# EAGLE design main (EAGLE 7.6.0)
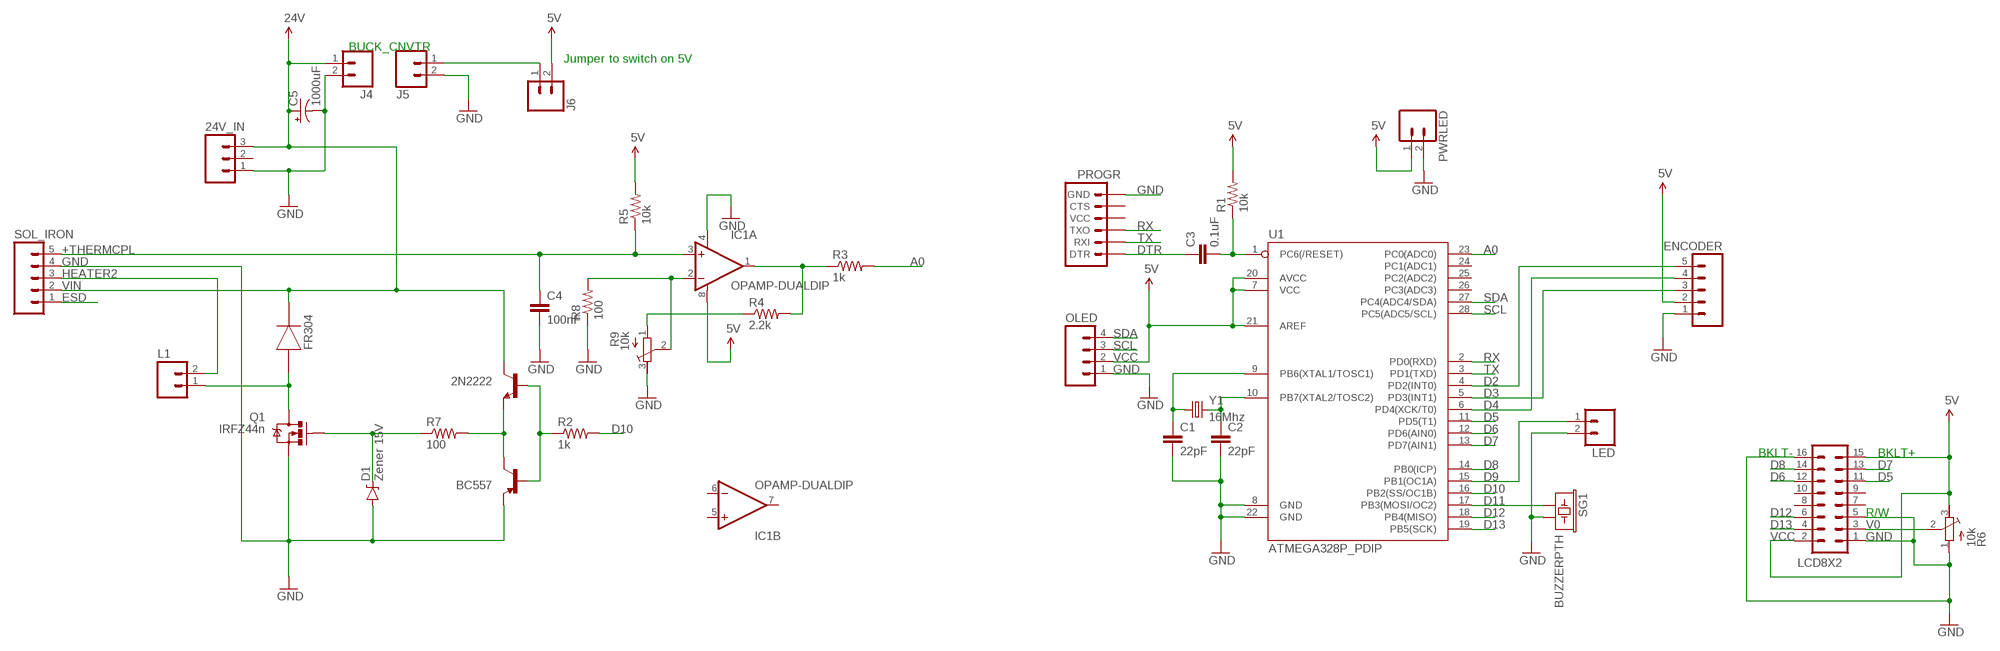
[diagram p0: schematic, sheet 1]

## Parts
2N2222  TRANSISTOR_NPNP2N2222A  [TO-92]
24V_IN  M03PTH  [1X03]
BC557  TRANSISTOR_PNPTO92  [TO-92]
C1  22pF  CAPPTH  [CAP-PTH-SMALL]
C2  22pF  CAPPTH  [CAP-PTH-SMALL]
C3  0.1uF  CAPPTH  [CAP-PTH-SMALL]
C4  100nF  CAPPTH  [CAP-PTH-SMALL]
C5  1000uF  CAP_POLPTH4  [CPOL-RADIAL-1000UF-25V]
D1  Zener 15V  DIODE-ZENERPTH  [DIODE-ZENER]
ENCODER  M05PTH  [1X05]
IC1  OPAMP-DUALDIP  [DIP08]
J4  M02PTH  [1X02]
J5  M02PTH  [1X02]
J6  M02PTH  [1X02]
L1  M02PTH  [1X02]
LCD8X2  M08X2  [2X8]
LED  M02PTH  [1X02]
OLED  M04PTH  [1X04]
PROGR  ARDUINO_SERIAL_PROGRAMPTH  [1X06]
PWRLED  M02PTH  [1X02]
Q1  IRFZ44n  MOSFET-NCHANNELFQP30N06L  [TO220V]
R1  10k  RESISTORPTH-1/4W  [AXIAL-0.4]
R2  1k  RESISTORPTH-1/4W  [AXIAL-0.4]
R3  1k  RESISTORPTH-1/4W  [AXIAL-0.4]
R4  2.2k  RESISTORPTH-1/4W  [AXIAL-0.4]
R5  10k  RESISTORPTH-1/4W  [AXIAL-0.4]
R6  10k  R-TRIMM3296W  [RTRIM3296W]
R7  100  RESISTORPTH-1/4W  [AXIAL-0.4]
R8  100  RESISTORPTH-1/4W  [AXIAL-0.4]
R9  10k  R-TRIMM3296W  [RTRIM3296W]
SG1  BUZZERPTH  [BUZZER-12MM]
SOL_IRON  M05PTH  [1X05]
U1  ATMEGA328P_PDIP  [DIL28-3]
U$1  FR304  [FR304]
Y1  16Mhz  CRYSTALHC49US  [HC49US]

## Nets
+THERMCPL: C4.1 IC1.3(A:+IN) R5.P$1 SOL_IRON.5
A0: R3.P$2 U1.23(PC0(ADC0))
D2: ENCODER.5 U1.4(PD2(INT0))
D3: ENCODER.3 U1.5(PD3(INT1))
D4: ENCODER.4 U1.6(PD4(XCK/T0))
D5: LCD8X2.11 U1.11(PD5(T1))
D6: LCD8X2.12 U1.12(PD6(AIN0))
D7: LCD8X2.13 U1.13(PD7(AIN1))
D8: LCD8X2.14 U1.14(PB0(ICP))
D9: LED.1 U1.15(PB1(OC1A))
D10: R2.P$2 U1.16(PB2(SS/OC1B))
D11: SG1.+ U1.17(PB3(MOSI/OC2))
D12: LCD8X2.6 U1.18(PB4(MISO))
D13: LCD8X2.4 U1.19(PB5(SCK))
DTR: C3.1 PROGR.1(DTR)
ESD: SOL_IRON.1
GND [ground]: 24V_IN.1 BC557.1(E) C1.2 C2.2 C4.2 C5.- D1.P$2(A) ENCODER.1 IC1.4(A:V-) J4.2 J5.2 LCD8X2.1 LCD8X2.5 LCD8X2.16 LED.2 OLED.1 PROGR.6(GND) PWRLED.2 Q1.3(S) R6.1(A) R8.P$1 R9.3(E) SG1.- SOL_IRON.4 U1.8(GND) U1.22(GND)
HEATER2: L1.2 SOL_IRON.3
N$1: C1.1 U1.9(PB6(XTAL1/TOSC1)) Y1.1
N$2: C2.1 U1.10(PB7(XTAL2/TOSC2)) Y1.2
N$4: C3.2 R1.P$1 U1.1(PC6(/RESET))
N$5: 2N2222.3(E) BC557.3(C) R7.P$2
N$6: D1.P$1(C) Q1.1(G) R7.P$1
N$7: L1.1 Q1.2(D) U$1.A(ANODE)
N$8: IC1.2(A:-IN) R8.P$2 R9.2(S)
N$9: 2N2222.2(B) BC557.2(B) R2.P$1
N$10: IC1.1(A:OUT) R3.P$1 R4.P$2
N$11: R4.P$1 R9.1(A)
N$15: J5.1 J6.1
RX: PROGR.3(TXO) U1.2(PD0(RXD))
SCL: OLED.3 U1.28(PC5(ADC5/SCL))
SDA: OLED.4 U1.27(PC4(ADC4/SDA))
TX: PROGR.2(RXI) U1.3(PD1(TXD))
V0: LCD8X2.3 R6.2(S)
VCC [5V]: ENCODER.2 IC1.8(A:V+) J6.2 LCD8X2.2 LCD8X2.15 OLED.2 PWRLED.1 R1.P$2 R5.P$2 R6.3(E) U1.7(VCC) U1.20(AVCC) U1.21(AREF) ; supply symbol labelled 5V
VIN [24V]: 2N2222.1(C) 24V_IN.3 C5.+ J4.1 SOL_IRON.2 U$1.K(CATHODE) ; supply symbol labelled 24V
Unconnected: 24V_IN.2 IC1.5(B:+IN) IC1.6(B:-IN) IC1.7(B:OUT) LCD8X2.7 LCD8X2.8 LCD8X2.9 LCD8X2.10 PROGR.4(VCC) PROGR.5(CTS) U1.24(PC1(ADC1)) U1.25(PC2(ADC2)) U1.26(PC3(ADC3))

## Notes on the sheet
- BUCK_CNVTR
- Jumper to switch on 5V
- BKLT- | BKLT+
- R/W

## Library data of the parts
2N2222 = SparkFun-DiscreteSemi:TRANSISTOR_NPN: Generic NPN BJT MMBT2222A - TRANS-08049 (SOT-23, 1A 40V) MPSA42 - TRANS-09116 (SOT-23, 500mA 300V) MMBT5088LT1G - TRANS-11160 (SOT-23, 50 mA 30V) BC547 - COM-08928 <http://www.sparkfun.com/products/8928> (TO-92 45V 100mA) (1.Collector 2.Base 3.Emitter) 2N3904 - COM-00521 <http://www.sparkfun.com/products/521> (TO-92 40V 200mA) (1.Emitter 2.Base 3.Collector) P2N2222A - COM-12852 <http://www.sparkfun.com/products/12852> (TO-92 40V 600mA) (1.Collector 2.Base 3.Emitter); PROD_ID: TRANS-09536
24V_IN = SparkFun-Connectors:M03: Header 3 Standard 3-pin 0.1" header. Use with straight break away headers (SKU : PRT-00116), right angle break away headers (PRT-00553), swiss pins (PRT-00743), machine pins (PRT-00117), and female headers (PRT-00115). Molex polarized connector foot print use with SKU : PRT-08232 with associated crimp pins and housings.
BC557 = SparkFun-DiscreteSemi:TRANSISTOR_PNP: Generic PNP BJT Double check pinouts against datasheets- not all devices are the same! MMBT3906 - 40V 200mA SOT-23 (TRANS-08052) MMBT4403 - 40V 600mA SOT-23 (TRANS-09245)
C1-C4 = SparkFun-Capacitors:CAP: Capacitor Standard 0603 ceramic capacitor, and 0.1" leaded capacitor.
C5 = SparkFun-Capacitors:CAP_POL: Capacitor Polarized These are standard SMD and PTH capacitors. Normally 10uF, 47uF, and 100uF in electrolytic and tantalum varieties. Always verify the external diameter of the through hole cap, it varies with capacity, voltage, and manufacturer. The EIA devices should be standard.
D1 = SparkFun-DiscreteSemi:DIODE-ZENER: Zener Diode Production Part - 8199 3.4V Zener Voltage
ENCODER SOL_IRON = SparkFun-Connectors:M05: Header 5 Standard 5-pin 0.1" header. Use with straight break away headers (SKU : PRT-00116), right angle break away headers (PRT-00553), swiss pins (PRT-00743), machine pins (PRT-00117), and female headers (PRT-00115). Molex polarized connector foot print use with SKU : PRT-08230 with associated crimp pins and housings.
IC1 = SparkFun-AnalogIC:OPAMP-DUAL: Generic op-amp footprint
J4-J6 L1 LED PWRLED = SparkFun-Connectors:M02: Standard 2-pin 0.1" header. Use with - straight break away headers ( PRT-00116) - right angle break away headers (PRT-00553) - swiss pins (PRT-00743) - machine pins (PRT-00117) - female headers (PRT-00115) Molex polarized connector foot print use with: PRT-08233 with associated crimp pins and housings. 2.54_SCREWTERM for use with PRT-10571. 3.5mm Screw Terminal footprints for PRT-08084 5mm Screw Terminal footprints for use with PRT-08432
LCD8X2 = SparkFun-Connectors:M08X2: .1" headers, two rows of 8 each
OLED = SparkFun-Connectors:M04: Header 4 Standard 4-pin 0.1" header. Use with straight break away headers (SKU : PRT-00116), right angle break away headers (PRT-00553), swiss pins (PRT-00743), machine pins (PRT-00117), and female headers (PRT-00115). Molex polarized connector foot print use with SKU : PRT-08231 with associated crimp pins and housings. 1MM SMD Version SKU: PRT-10208; PROD_ID: CONN-09696
PROGR = SparkFun-Connectors:ARDUINO_SERIAL_PROGRAM: FTDI connector footprints
Q1 = SparkFun-DiscreteSemi:MOSFET-NCHANNEL: Common NMOSFET Parts MFG P/N Store ID Prod ID FDD8780 TRANS-09984 SI7820DN TRANS-11055 FDS6630A IC-08089 2N7002PW TRANS-11151 FQP30N06L COM-10213 TRANS-10060 BSS123LT1G TRANS-08345 BSS138 TRANS-00830 BS170 2N7000; PROD_ID: TRANS-10060
R1-R5 R7 R8 = SparkFun-Resistors:RESISTOR: Resistor Basic schematic elements and footprints for 0603, 1206, and PTH resistors.
R6 R9 = resistor:R-TRIMM: Trimm resistor
SG1 = SparkFun-Electromechanical:BUZZER: Buzzer 12mm Spark Fun Electronics SKU : Comp-Buzzer
U1 = SparkFun-DigitalIC:ATMEGA328P_PDIP: uC used in the Arduino 32kb flash, 1k EEPROM, 2k SRAM This is the through-hole version of this chip.
U$1 = Created:FR304
Y1 = SparkFun-FreqCtrl:CRYSTAL: Various standard crystals. Proven footprints.

## Net classes
0 default: width 0.406 mm, clearance 0.203 mm
1 ground: width 0.61 mm, clearance 0.203 mm
2 24V: width 1.016 mm, clearance 0.203 mm
3 5V: width 0.61 mm, clearance 0.203 mm

## Board
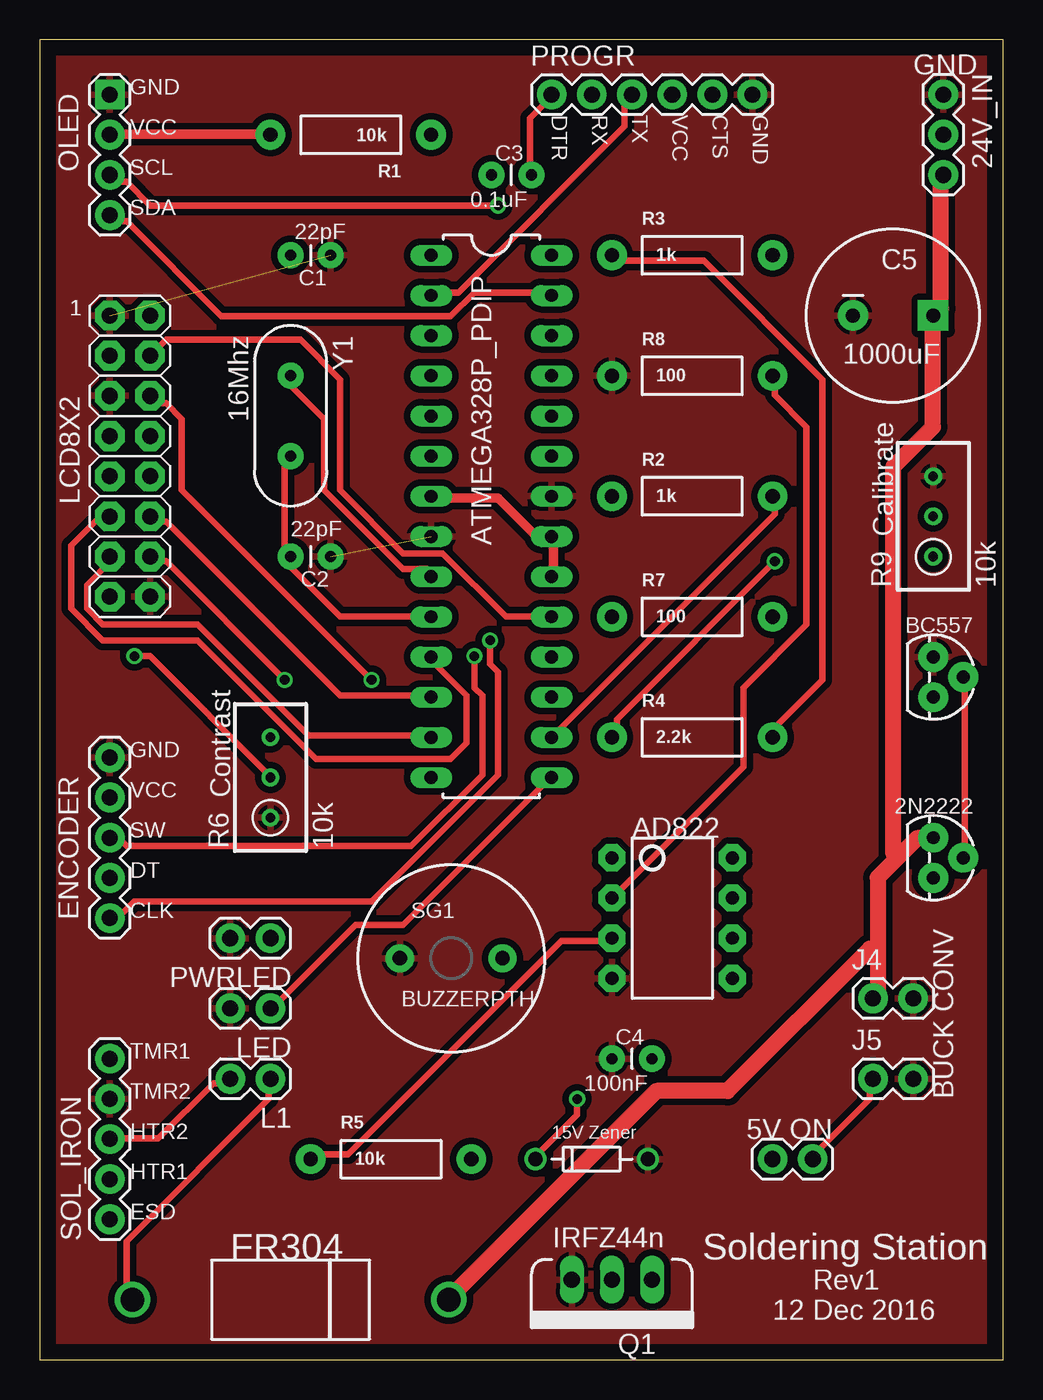
[diagram p1: board, top side]
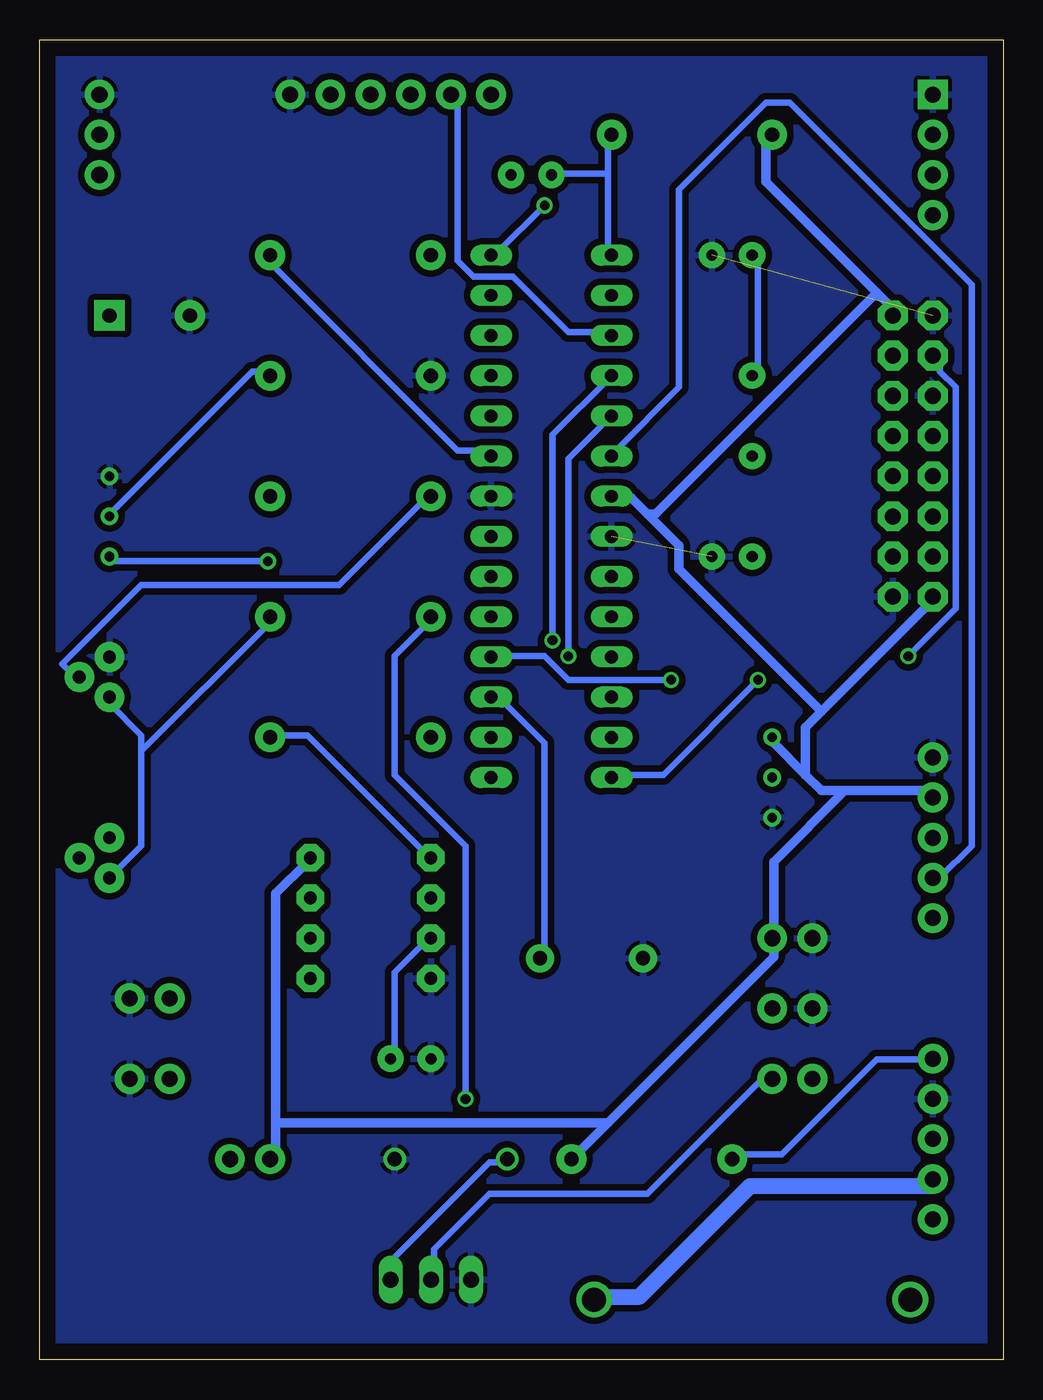
[diagram p2: board, bottom side, seen from below]

Size 60.94 x 83.49 mm. Coordinates in mm from the lower left corner, seen from the top.
Outline: 0,0 60.94,0 60.94,83.49 0,83.49 0,0
Copper layers (1*16): Top 0.035mm / dielectric 1.5mm / Bottom 0.035mm
Design rules "default": minimum track width 10mil, minimum drill 24mil, track to track 8mil, track to pad 8mil, pad to pad 8mil, via to via 8mil, smd to smd 8mil, copper to edge 40mil, drill to drill 8mil, minimum pad ring 10mil, minimum via ring 8mil, stop-mask expansion 4mil, vias tented up to drill 0mil, thermal gap 10mil

### Footprints (pad centres in the part's own frame; a part is rotated, then mirrored left to right if it is on the bottom)
TO-92 = drill 0.813 pad 1.88: 1 -1.27,0; 2 0,1.905; 3 1.27,0
1X03 = drill 1.016 pad 1.88: 1 0,0; 2 2.54,0; 3 5.08,0
CAP-PTH-SMALL = drill 0.7 pad 1.651: 1 0,0; 2 2.54,0
CPOL-RADIAL-1000UF-25V = drill 0.9 pad 1.93 square: + 2.54,0 | drill 0.9 pad 1.93: - -2.54,0
DIODE-ZENER = drill 0.9: P$1 -3.556,0; P$2 3.556,0
1X05 = drill 1.016 pad 1.88: 1 0,0; 2 2.54,0; 3 5.08,0; 4 7.62,0; 5 10.16,0
DIP08 = drill 0.813 pad 1.727 octagon: 1 -3.81,-3.81; 2 -1.27,-3.81; 3 1.27,-3.81; 4 3.81,-3.81; 5 3.81,3.81; 6 1.27,3.81; 7 -1.27,3.81; 8 -3.81,3.81
1X02 = drill 1.016 pad 1.88: 1 0,0; 2 2.54,0
2X8 = drill 1.016 pad 1.88 octagon: 1 0,0; 2 0,2.54; 3 2.54,0; 4 2.54,2.54; 5 5.08,0; 6 5.08,2.54; 7 7.62,0; 8 7.62,2.54; 9 10.16,0; 10 10.16,2.54; 11 12.7,0; 12 12.7,2.54; 13 15.24,0; 14 15.24,2.54; 15 17.78,0; 16 17.78,2.54
1X04 = drill 1.016 pad 1.88 square: 1 0,0 | drill 1.016 pad 1.88: 2 2.54,0; 3 5.08,0; 4 7.62,0
1X06 = drill 1.016 pad 1.88: 1 0,0; 2 2.54,0; 3 5.08,0; 4 7.62,0; 5 10.16,0; 6 12.7,0
TO220V = drill 1.016 long: 1 -2.54,0; 2 0,0; 3 2.54,0
AXIAL-0.4 = drill 0.9 pad 1.88: P$1 -5.08,0; P$2 5.08,0
RTRIM3296W = drill 0.61: 1 0,-2.54; 2 0,0; 3 0,2.54
BUZZER-12MM = drill 0.9 pad 1.778: + 3.25,0; - -3.25,0
DIL28-3 = drill 0.813 long: 1 -16.51,-3.81; 2 -13.97,-3.81; 3 -11.43,-3.81; 4 -8.89,-3.81; 5 -6.35,-3.81; 6 -3.81,-3.81; 7 -1.27,-3.81; 8 1.27,-3.81; 9 3.81,-3.81; 10 6.35,-3.81; 11 8.89,-3.81; 12 11.43,-3.81; 13 13.97,-3.81; 14 16.51,-3.81; 15 16.51,3.81; 16 13.97,3.81; 17 11.43,3.81; 18 8.89,3.81; 19 6.35,3.81; 20 3.81,3.81; 21 1.27,3.81; 22 -1.27,3.81; 23 -3.81,3.81; 24 -6.35,3.81; 25 -8.89,3.81; 26 -11.43,3.81; 27 -13.97,3.81; 28 -16.51,3.81
FR304 = drill 1.5 pad 2.184: A -10,0; K 10,0
HC49US = drill 0.7 pad 1.651: 1 -2.54,0; 2 2.54,0

### Placement (x,y rotation side)
2N2222  56.52,31.75 270 top
24V_IN  57.15,80.01 270 top
BC557  56.52,43.18 270 top
C1  15.88,69.85 0 top
C2  15.88,50.8 0 top
C3  31.11,74.93 180 top
C4  38.73,19.05 180 top
C5  53.98,66.04 0 top
D1  34.92,12.7 0 top
ENCODER  4.45,38.1 270 top
IC1  40.01,27.94 270 top
J4  52.7,22.86 0 top
J5  52.7,17.78 0 top
J6  48.9,12.7 180 top
L1  14.61,17.78 180 top
LCD8X2  4.45,66.04 270 top
LED  14.61,22.23 180 top
OLED  4.45,80.01 270 top
PROGR  32.38,80.01 0 top
PWRLED  14.61,26.67 180 top
Q1  36.2,5.08 180 top
R1  19.68,77.47 180 top
R2  41.27,54.61 0 top
R3  41.27,69.85 0 top
R4  41.27,39.37 0 top
R5  22.23,12.7 0 top
R6  14.61,36.83 0 top
R7  41.27,46.99 0 top
R8  41.27,62.23 0 top
R9  56.52,53.34 0 top
SG1  26.04,25.4 0 top
SOL_IRON  4.45,8.89 90 top
U1  28.57,53.34 270 top
U$1  15.88,3.81 0 top
Y1  15.88,59.69 270 top

### Tracks (layer width: path | path; a pad name or v marks a point on that pad's centre or on a via)
+THERMCPL
  Top 0.406: IC1.3 36,26.5 33,26.5 19.5,13 17.5,13 R5.P$1
  Bottom 0.406: C4.1 38.5,19.5 38.5,24.5 36.5,26.5 IC1.3 | SOL_IRON.5 4.5,19 8,19 14,13 17,13 R5.P$1
A0
  Bottom 0.406: U1.23 32.5,57.5 34.5,57.5 46.5,69.5 R3.P$2
D2  (via drill 0.61)
  Top 0.406: v28.5,45.5 28.5,44 29,43.5 29,37 21,29 6,29 4.5,27.5 ENCODER.5
  Bottom 0.406: v28.5,45.5 28.5,58.5 25,62 U1.4
D3  (via drill 0.61)
  Top 0.406: v27.5,44.5 27.5,42.5 28,42 28,37 23.5,32.5 5.5,32.5 4.5,33.5 ENCODER.3
  Bottom 0.406: v27.5,44.5 27.5,57 25,59.5 U1.5
D4
  Bottom 0.406: U1.6 24.5,57.5 20.5,61.5 20.5,74 15,79.5 13.5,79.5 2,68 2,32.5 4,30.5 ENCODER.4
D5
  Top 0.406: U1.11 25,44 27,42 27,39 26,38 17.5,38 10,45.5 4,45.5 2,47.5 2,51.5 4,53.5 LCD8X2.11
D6
  Top 0.406: U1.12 24.5,42 19,42 8,53 7,53 LCD8X2.12
D7
  Top 0.406: U1.13 24.5,39.5 17,39.5 10,46.5 4,46.5 3,47.5 3,49 4.5,50.5 LCD8X2.13
D8  (via drill 0.61)
  Top 0.406: v15.5,43 8,50.5 7,50.5 LCD8X2.14
  Bottom 0.406: v15.5,43 21.5,37 24.5,37 U1.14
D9
  Top 0.406: U1.15 32,36.5 23,27.5 20,27.5 15,22.5 LED.1
D10
  Top 0.406: U1.16 32.5,39.5 46.5,53.5 46.5,54.5 R2.P$2
D11
  Bottom 0.406: U1.17 32,41.5 31.5,41.5 29,39 29,25.5 SG1.+
D12  (via drill 0.61)
  Top 0.406: v21,43 9,55 9,59.5 8,60.5 7,60.5 LCD8X2.6
  Bottom 0.406: v21,43 27.5,43 29,44.5 32,44.5 U1.18
D13
  Top 0.406: U1.19 32,47 29.5,47 25.5,51 23,51 19,55 19,62 16.5,64.5 8,64.5 LCD8X2.4
DTR
  Top 0.406: C3.1 31,75 31,78.5 32.5,80 PROGR.1
GND  (2 unrouted)
  pour Bottom (isolate 0.406): 0,0 0,83.82 60.96,83.82 60.96,0
  pour Top (isolate 0.406): 0,0 0,83.82 60.96,83.82 60.96,0
HEATER2
  Top 0.406: SOL_IRON.3 4.5,14 7.5,14 11,17.5 12,17.5 L1.2
N$1
  Top 0.406: U1.9 24.5,50 23,50 18,55 18,59.5 15.5,62 Y1.1
  Bottom 0.406: C1.1 15.5,69.5 15.5,62.5 Y1.1
N$2
  Top 0.406: U1.10 24.5,47 19,47 15.5,50.5 C2.1 15.5,51 15.5,57 Y1.2
N$4
  Bottom 0.406: 25,75 25,77 R1.P$1 | 25,75 25,70 U1.1 | 25,75 28.5,75 C3.2
N$5
  Bottom 0.406: 54.5,38.5 54.5,39.5 56.5,41.5 BC557.3 | 54.5,38.5 54.5,32.5 56.5,30.5 2N2222.3 | 54.5,38.5 46.5,46.5 R7.P$2
N$6  (via drill 0.61)
  Top 0.406: v34,16.5 34,15.5 31.5,13 D1.P$1
  Bottom 0.406: D1.P$1 31.5,12.5 32.5,12.5 38.5,6.5 38.5,5.5 Q1.1 | v34,16.5 34,32.5 38.5,37 38.5,44.5 36.5,46.5 R7.P$1
N$7
  Top 0.406: U$1.A 5.5,4 5.5,7.5 14.5,16.5 14.5,17.5 L1.1
  Bottom 0.406: Q1.2 36,5.5 36,7 32.5,10.5 22.5,10.5 15,18 L1.1
N$8
  Top 0.406: IC1.2 36.5,29.5 44.5,37.5 44.5,42.5 48.5,46.5 48.5,59 46.5,61 46.5,62 R8.P$2
  Bottom 0.406: R9.2 56.5,53.5 47.5,62.5 46.5,62.5 R8.P$2
N$9
  Top 0.406: 2N2222.2 58.5,32 58.5,43 BC557.2
  Bottom 0.406: R2.P$1 36.5,54.5 42,49 54.5,49 59.5,44 58.5,43 BC557.2
N$10
  Top 0.406: R3.P$1 36.5,69.5 42,69.5 49.5,62 49.5,43 46,39.5 R4.P$2
  Bottom 0.406: IC1.1 36.5,32 44,39.5 46,39.5 R4.P$2
N$11  (via drill 0.61)
  Top 0.406: v46.5,50.5 36.5,40.5 36.5,39.5 R4.P$1
  Bottom 0.406: v46.5,50.5 56.5,50.5 R9.1
N$15
  Top 0.406: J6.1 49,13 52.5,16.5 52.5,17.5 J5.1
RX
  Top 0.406: U1.2 25,67.5 26.5,67.5 37,78 37,80 PROGR.3
SCL  (via drill 0.61)
  Top 0.406: v29,73 7,73 5.5,74.5 4.5,74.5 OLED.3
  Bottom 0.406: v29,73 32,70 U1.28
SDA
  Top 0.406: U1.27 32,67.5 27.5,67.5 26,66 11.5,66 5.5,72 4.5,72 OLED.4
TX
  Bottom 0.406: U1.3 25,65 27.5,65 31,68.5 33.5,68.5 34.5,69.5 34.5,80 PROGR.2
V0  (via drill 0.61)
  Top 0.406: v6,44.5 7,44.5 14.5,37 R6.2
  Bottom 0.406: v6,44.5 3,47.5 3,61.5 4,62.5 4,63.5 LCD8X2.3
VCC
  Top 0.61: OLED.2 4.5,77.5 14.5,77.5 R1.P$2 | U1.20 32.5,50 32.5,52 U1.21 32,52 31.5,52 29,54.5 25,54.5 U1.7
  Bottom 0.61: 8,67.5 15,74.5 15,77 R1.P$2 | 8,67.5 7,66.5 LCD8X2.2 | 46,15 46,13 J6.2 | 46,15 46,29.5 44,31.5 IC1.8 | 12.5,37 11.5,36 10,36 | 12.5,37 14.5,39 R6.3 | 10,36 4.5,36 ENCODER.2 | 10,36 14.5,31.5 14.5,27 PWRLED.1 14.5,26.5 14.5,25.5 25,15 | 11.5,41 12.5,40 12.5,37 | 11.5,41 4.5,48 LCD8X2.15 | 25,15 27,13 R5.P$2 | 22.5,53.5 20.5,51.5 20.5,50 11.5,41 | 22.5,53.5 23.5,54.5 24.5,54.5 U1.7 | 25,15 46,15 | 8,67.5 22,53.5 22.5,53.5
VIN
  Top 1.016: 24V_IN.3 57,74.5 57,66.5 C5.+ 56.5,66 56.5,59 54,56.5 54,32 54.25,31.75 | 53,26 53,30.5 54.25,31.75 | 53,26 53,23 J4.1 | 54.25,31.75 55.5,33 56.5,33 2N2222.1 | U$1.K 26,4 39,17 43.5,17 52.5,26 53,26
  Bottom 1.016: SOL_IRON.2 4.5,11 16,11 23,4 25.5,4 U$1.K

### Text on the board
tPlace: GND | GND | DTR | RX | TX | VCC | CTS | GND | VCC | SCL | SDA | 1 | 22pF | Calibrate | C2 | BC557 | GND | VCC | Contrast | 2N2222 | SW | AD822 | DT | CLK | TMR1 | TMR2 | BUCK CONV | 5V ON | HTR2 | 15V Zener | HTR1 | ESD | FR304 | Soldering Station | Rev1 | 12 Dec 2016